# Altium schematic sheet Driver_Sheet.SchDoc
size B
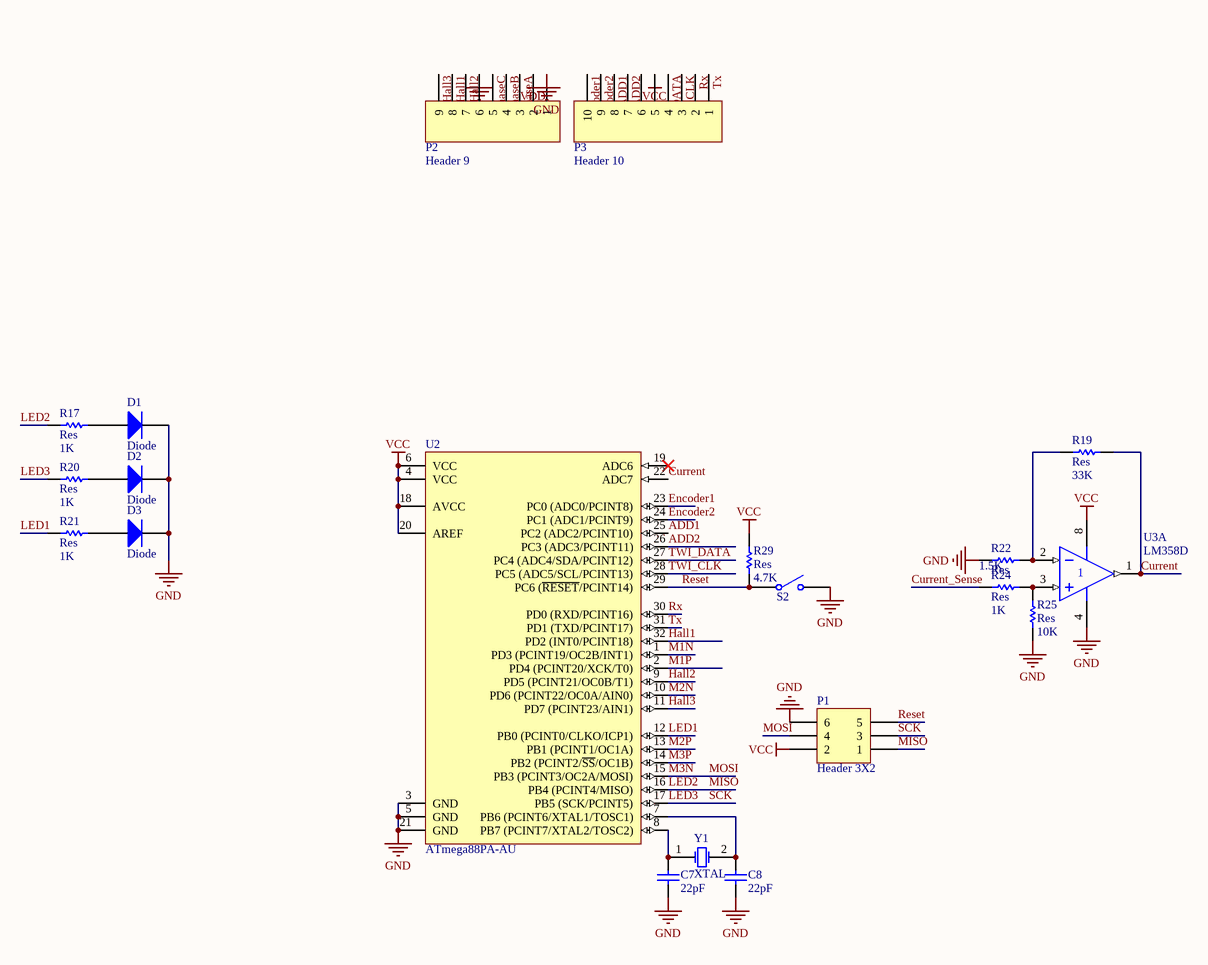
[diagram p0: Driver_Sheet.SchDoc]

## Parts
C7  value 22pF  [2012[0805]]  (hidden comment: Cap_UP)
C8  value 22pF  [2012[0805]]  (hidden comment: Cap_UP)
D1  Diode  [2012[0805]]
D2  Diode  [2012[0805]]
D3  Diode  [2012[0805]]
P1  Header 3X2  [HDRBOX2X3]
P2  Header 9  [HDR1X9]
P3  Header 10  [HDR1X10]
R17  Res  value 1K  [2012[0805]]
R19  Res  value 33K  [2012[0805]]
R20  Res  value 1K  [2012[0805]]
R21  Res  value 1K  [2012[0805]]
R22  Res  value 1.5K  [2012[0805]]
R24  Res  value 1K  [2012[0805]]
R25  Res  value 10K  [2012[0805]]
R29  Res  value 4.7K  [2012[0805]]
S2  SW-SPST  [PUSH-BUT-SMD]  (value not drawn)
U2  ATmega88PA-AU  [32A_N]
U3  LM358D  [751-02_N]  (part A of 2)
Y1  XTAL  [XTALL]

## Nets
GND: C7.1 C8.1 D1.2(K) D2.2(K) D3.2(K) P1.6 P2.1 P2.6 R22.2 R25.1 S2.2(NO) U2.3(GND) U2.5(GND) U2.21(GND) U3.4(V-)
VCC: P1.2 P3.5 R29.2 U2.4(VCC) U2.6(VCC) U2.18(AVCC) U2.20(AREF) U3.8(V+)
VDD: P2.2
ADD1: P3.8 U2.25(PC2_(ADC2/PCINT10))
ADD2: P3.7 U2.26(PC3_(ADC3/PCINT11))
Current: R19.1 U2.22(ADC7) U3.1(OUT)
Current_Sense: R24.2
Encoder1: P3.10 U2.23(PC0_(ADC0/PCINT8))
Encoder2: P3.9 U2.24(PC1_(ADC1/PCINT9))
Hall1: P2.8 U2.32(PD2_(INT0/PCINT18))
Hall2: P2.7 U2.9(PD5_(PCINT21/OC0B/T1))
Hall3: P2.9 U2.11(PD7_(PCINT23/AIN1))
LED1: R21.1 U2.12(PB0_(PCINT0/CLKO/ICP1))
LED2: P1.1 R17.1 U2.16(PB4_(PCINT4/MISO))  [also labelled MISO]
LED3: P1.3 R20.1 U2.17(PB5_(SCK/PCINT5))  [also labelled SCK]
M1N: U2.1(PD3_(PCINT19/OC2B/INT1))
M1P: U2.2(PD4_(PCINT20/XCK/T0))
M2N: U2.10(PD6_(PCINT22/OC0A/AIN0))
M2P: U2.13(PB1_(PCINT1/OC1A))
M3N: P1.4 U2.15(PB3_(PCINT3/OC2A/MOSI))  [also labelled MOSI]
M3P: U2.14(PB2_(PCINT2/~{SS}/OC1B))
PhaseA: P2.3
PhaseB: P2.4
PhaseC: P2.5
Reset: P1.5 R29.1 S2.1(COMMON) U2.29(PC6_(~{RESET}/PCINT14))
Rx: P3.2 U2.30(PD0_(RXD/PCINT16))
TWI_CLK: P3.3 U2.28(PC5_(ADC5/SCL/PCINT13))
TWI_DATA: P3.4 U2.27(PC4_(ADC4/SDA/PCINT12))
Tx: P3.1 U2.31(PD1_(TXD/PCINT17))
NetC7_2: C7.2 U2.8(PB7_(PCINT7/XTAL2/TOSC2)) Y1.1(OSC1)
NetC8_2: C8.2 U2.7(PB6_(PCINT6/XTAL1/TOSC1)) Y1.2(OSC2)
NetD1_1: D1.1(A) R17.2
NetD2_1: D2.1(A) R20.2
NetD3_1: D3.1(A) R21.2
NetR19_2: R19.2 R22.1 U3.2(IN-)
NetR24_1: R24.1 R25.2 U3.3(IN+)

Not connected (* = marked no-connect by the designer): P3 6; U2 19(ADC6)*

## Library data of the parts
C7 C8 = Cap_UP: Capacitor; Published: 8-Jun-2000; LatestRevisionDate: 17-Jul-2002; LatestRevisionNote: Re-released for DXP Platform.; PackageReference: RAD-0.3; Publisher: Altium Limited
D1-D3 = Diode: 1 Amp General Purpose Rectifier; Revision 1: 11-Jul-2000: SIM Model Added.; Revision 2: 17-Jul-2002: Re-released for DXP Platform.; Package Information: Latest Revision: Aug-1999; Code - JEDEC: DO-204-AL; Published: 8-Jun-2000; Datasheet: Latest Revision: 1998; Package Reference: DO-41; Publisher: Altium Limited
P1 = Header 3X2: Header, 3-Pin, Dual row; LatestRevisionDate: 17-Jul-2002; LatestRevisionNote: Re-released for DXP Platform.; Publisher: Altium Limited
P2 = Header 9: Header, 9-Pin; LatestRevisionDate: 17-Jul-2002; LatestRevisionNote: Re-released for DXP Platform.; Publisher: Altium Limited
P3 = Header 10: Header, 10-Pin; LatestRevisionDate: 17-Jul-2002; LatestRevisionNote: Re-released for DXP Platform.; Publisher: Altium Limited
R17 R19-R22 R24 R25 R29 = Res: Semiconductor Resistor; Published: 8-Jun-2000; LatestRevisionDate: 17-Jul-2002; LatestRevisionNote: Re-released for DXP Platform.; PackageReference: AXIAL-0.5; Publisher: Altium Limited
S2 = SW-SPST: Single-Pole, Single-Throw Switch; Published: 24-Mar-1999; Revision: July-2002: Re-released for DXP Platform.; Publisher: Altium Limited
U2 = ATmega88PA-AU: 8-bit AVR Microcontroller, 8KB Flash, 512 Bytes EEPROM, 1KB SRAM, 32-pin TQFP, Industrial Grade (-40°C to 85°C); Published: 1-Apr-2010; DatasheetVersion: revA, Jan-2010; PackageVersion: revB, Oct-2001; PackageReference: 32A; Publisher: Altium Limited; PackageDescription: 32-Lead, 7x7x1.0 mm Body, 0.8mm Lead Pitch, Thin Profile Plastic Quad Flat Package (TQFP); Supplier 1: Digi-Key; Supplier Part Number 1: ATMEGA88PA-AU-ND; Supplier 2: Farnell; Supplier Part Number 2: 1715490; Supplier 3: Mouser; Supplier Part Number 3: 556-ATMEGA88PA-AU; Code_JEDEC: MS-026-ABA; ComponentLink1Description: Manufacturer Link; ComponentLink1URL: http://www.atmel.com/products/avr/default.asp?; ComponentLink2Description: ATmega48A/48PA/88A/88PA/168A/168PA/328/328P Datasheet; ComponentLink2URL: http://www.atmel.com/dyn/resources/prod_documents/8271.pdf; ComponentLink3Description: ATmega48A/48PA/88A/88PA/168A/168PA/328/328P Summary; ComponentLink3URL: http://www.atmel.com/dyn/resources/prod_documents/8271S.pdf; ComponentLink4Description: Atmel.com Home; ComponentLink4URL: http://www.atmel.com
U3 = LM358D: Dual Low-Power Operational Amplifier; Published: 17-Jul-2002; LatestRevisionDate: 13-Apr-2006; LatestRevisionNote: IPC-7351 Footprint Added.; DatasheetVersion: 1988; PackageReference: 751-02; Publisher: Altium Limited; PackageDescription: 8-Pin Small Outline Integrated Circuit 1.27 mm Pitch; Code_JEDEC: MS-012-AA; Code_IPC: SOIC127P600-8; ComponentLink1Description: Manufacturer Link; ComponentLink1URL: http://www.onsemi.com/site/products/parametrics/0,4446,251,00.html; ComponentLink2Description: Datasheet; ComponentLink2URL: http://www.onsemi.com/pub/Collateral/LM358-D.PDF
Y1 = XTAL: Crystal Oscillator; Published: 8-Jun-2000; LatestRevisionDate: 17-Jul-2002; LatestRevisionNote: Re-released for DXP Platform.; PackageReference: R38; Publisher: Altium Limited